# EAGLE design Projekt2 (EAGLE 8.4.0)
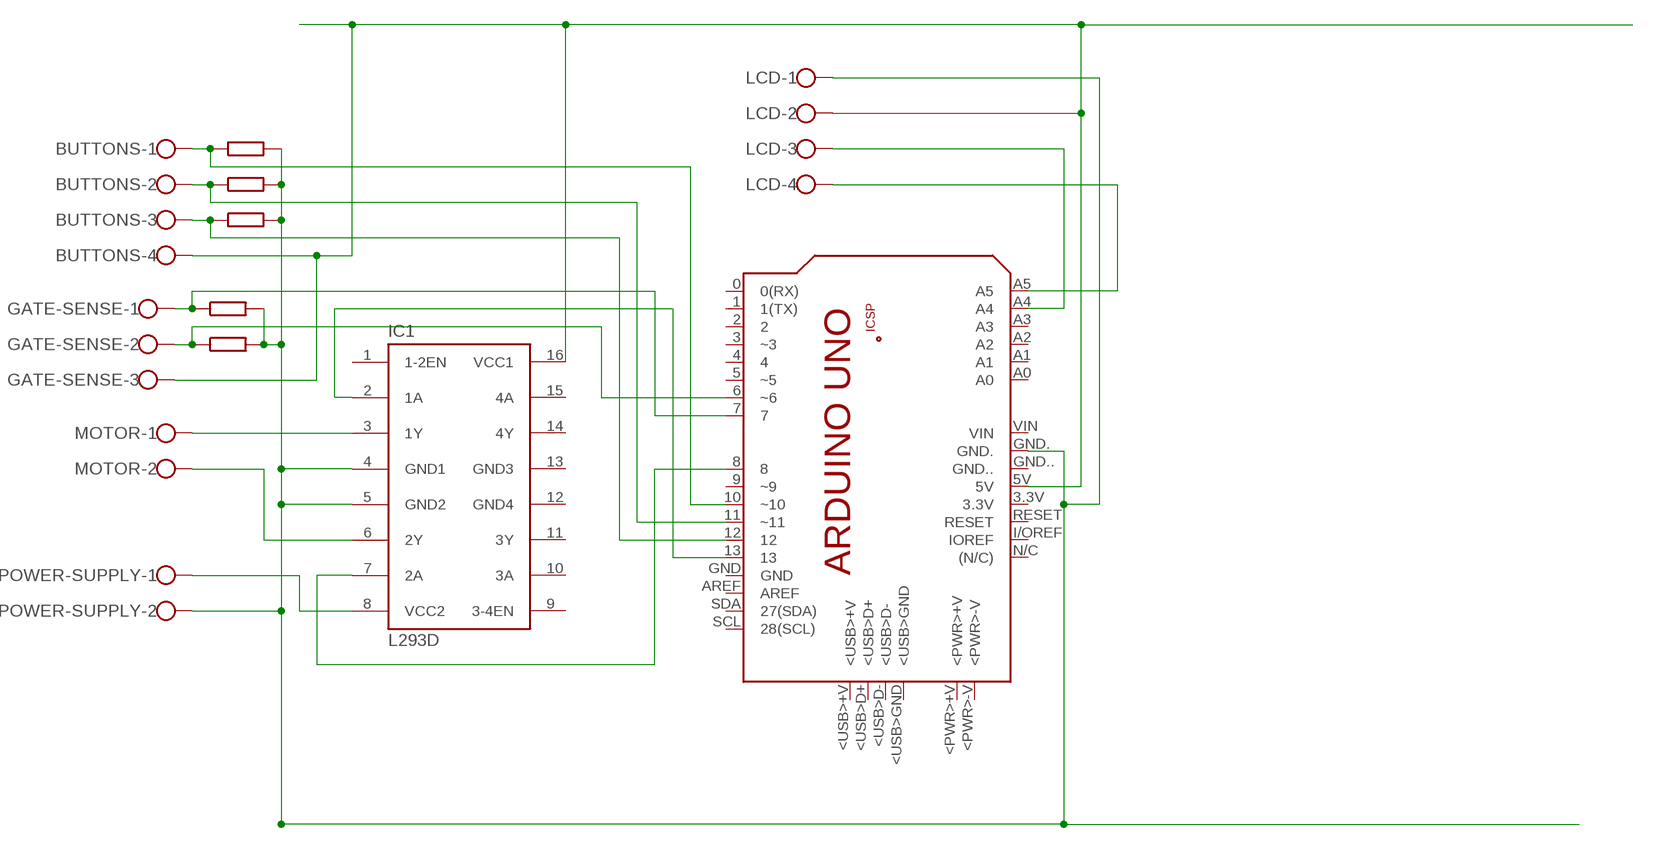
[diagram p0: schematic, sheet 1]

## Parts
BUTTONS  W239-104  [W239-104]
GATE-SENSE  W237-103  [W237-103]
IC1  L293D  [DIL16]
LCD  W237-4  [W237-4]
MOTOR  W237-102  [W237-102]
PCB1  ARDUINO_UNO  [ARDUINO_UNO]
POWER-SUPPLY  W237-102  [W237-102]

## Nets
N$1: IC1.4(GND1) IC1.5(GND2) LCD.1 PCB1.GND. POWER-SUPPLY.2
N$2: BUTTONS.4 GATE-SENSE.3 IC1.16(VCC1) LCD.2 PCB1.5V
N$3: IC1.2(1A) PCB1.13
N$4: IC1.3(1Y) MOTOR.1
N$5: IC1.6(2Y) MOTOR.2
N$6: IC1.7(2A) PCB1.8
N$7: IC1.8(VCC2) POWER-SUPPLY.1
N$8: BUTTONS.1 PCB1.10(~10)
N$9: BUTTONS.2 PCB1.11(~11)
N$10: BUTTONS.3 PCB1.12
N$11: GATE-SENSE.1 PCB1.7
N$12: GATE-SENSE.2 PCB1.6(~6)
N$14: LCD.3 PCB1.A4
N$15: LCD.4 PCB1.A5
Unconnected: IC1.1(1-2EN) IC1.9(3-4EN) IC1.10(3A) IC1.11(3Y) IC1.14(4Y) IC1.15(4A) PCB1.0(0(RX)) PCB1.1(1(TX)) PCB1.2 PCB1.3(~3) PCB1.3.3V PCB1.4 PCB1.5(~5) PCB1.9(~9) PCB1.+5V PCB1.<PWR>+V PCB1.<PWR>-V PCB1.<USB>+V PCB1.<USB>D+ PCB1.<USB>D- PCB1.<USB>GND PCB1.A0 PCB1.A1 PCB1.A2 PCB1.A3 PCB1.AREF PCB1.GND PCB1.GND.. PCB1.GND_ PCB1.I/OREF(IOREF) PCB1.MISO PCB1.MOSI PCB1.N/C((N/C)) PCB1.RESET PCB1.RESET. PCB1.SCK PCB1.SCL(28(SCL)) PCB1.SDA(27(SDA)) PCB1.VIN

## Power pins joined to a net without a drawn wire
GND3: IC1.13(GND3)
GND4: IC1.12(GND4)

## Library data of the parts
BUTTONS = con-wago-500:W239-104: WAGO SCREW CLAMP; OC_FARNELL: unknown; OC_NEWARK: unknown
GATE-SENSE = con-wago-500:W237-103: WAGO SCREW CLAMP; MPN: 237-103; OC_FARNELL: unknown; OC_NEWARK: 18M7116
IC1 = st-microelectronics:L293D: PUSH-PULL 4 CHANNEL DRIVER; MPN: L293D; OC_FARNELL: 9589619; OC_NEWARK: 56P8249
LCD = con-wago-500:W237-4: WAGO SCREW CLAMP; OC_FARNELL: unknown; OC_NEWARK: unknown
MOTOR POWER-SUPPLY = con-wago-500:W237-102: WAGO SCREW CLAMP; MPN: 237-102; OC_FARNELL: unknown; OC_NEWARK: 70K9898
PCB1 = E14_Arduino_revC:ARDUINO_UNO: Device for representing an Arduino Uno board with a footprint in an EAGLE design. Created by Dave Young for Element14. More EAGLE documentation at: http://www.element14.com/community/community/knode/cadsoft_eagle

## Board
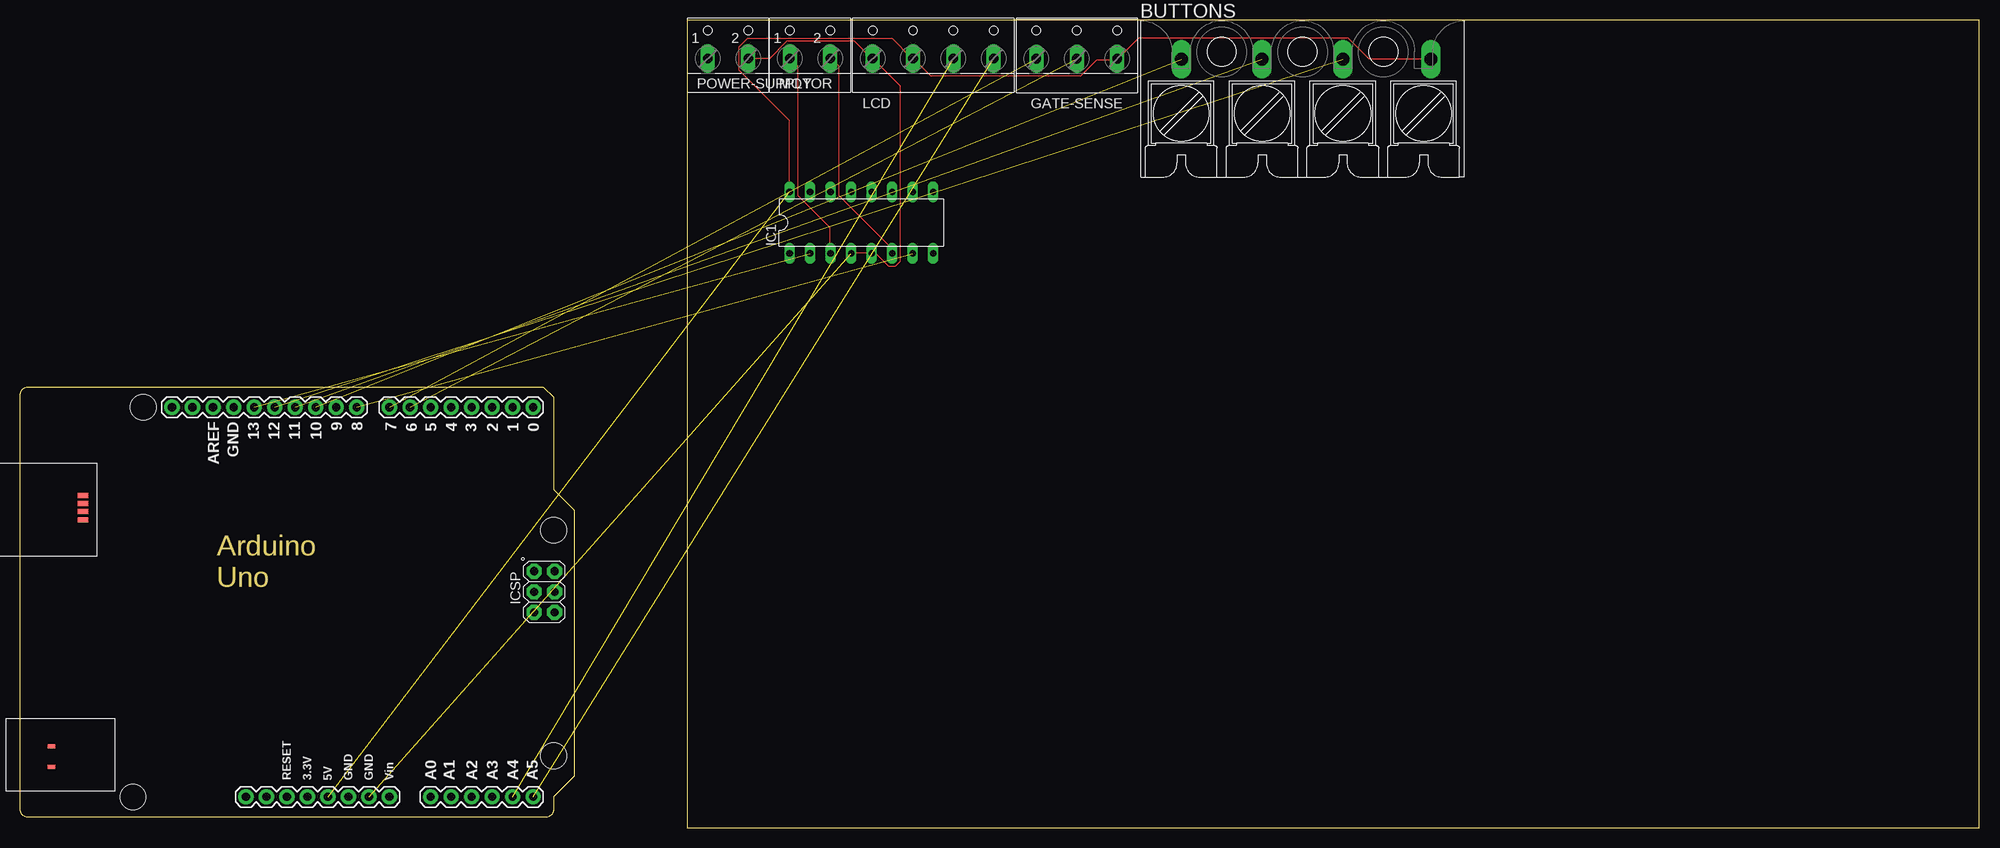
[diagram p1: board, top side]
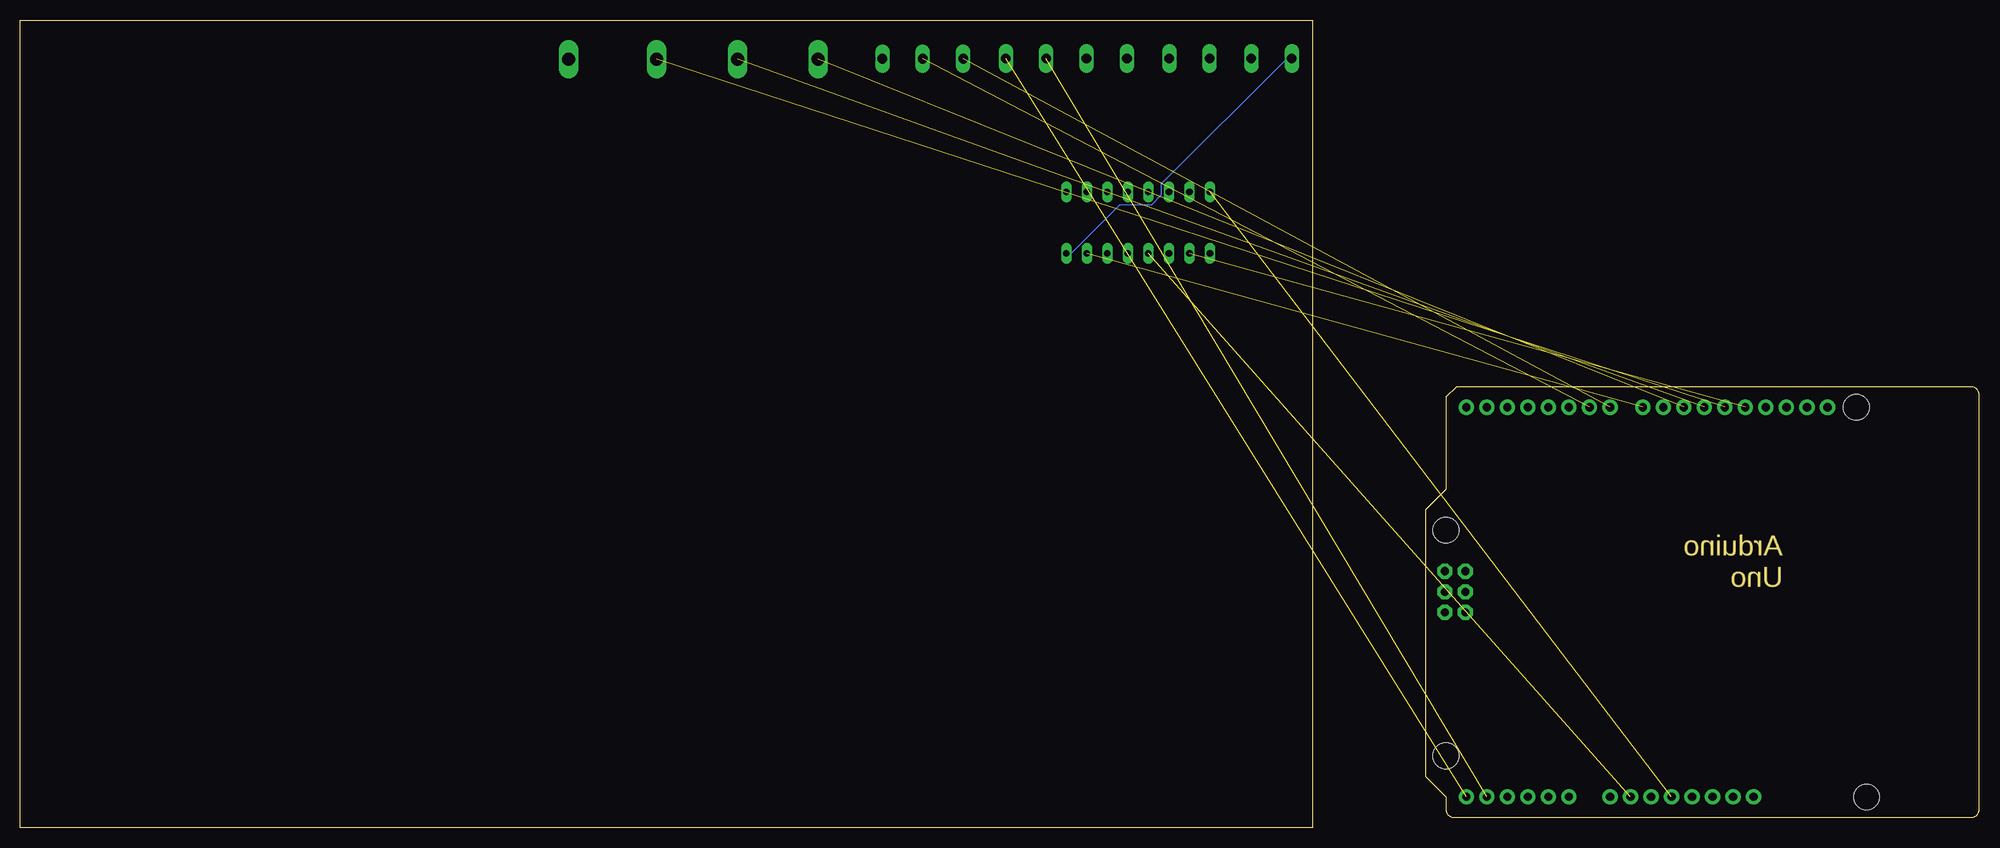
[diagram p2: board, bottom side, seen from below]

Size 160 x 100 mm. Coordinates in mm from the lower left corner, seen from the top.
Outline: 0,0 160,0 160,100 0,100 0,0
Copper layers (1*16): Top 0.035mm / dielectric 1.5mm / Bottom 0.035mm
Design rules "default": minimum track width 6mil, minimum drill 0.35mm, track to track 6mil, track to pad 6mil, pad to pad 6mil, via to via 6mil, smd to smd 6mil, copper to edge 40mil, drill to drill 6mil, minimum pad ring 10mil, minimum via ring 8mil, stop-mask expansion 4mil, vias tented up to drill 0mil, thermal gap 10mil

### Footprints (pad centres in the part's own frame; a part is rotated, then mirrored left to right if it is on the bottom)
W239-104 = drill 1.6 long: 1 -15,5; 2 -5,5; 3 5,5; 4 15.9,5
W237-103 = drill 1.194 long: 1 -5,-1.29; 2 0,-1.29; 3 5,-1.29
DIL16 = drill 0.813 long: 1 -8.89,-3.81; 2 -6.35,-3.81; 3 -3.81,-3.81; 4 -1.27,-3.81; 5 1.27,-3.81; 6 3.81,-3.81; 7 6.35,-3.81; 8 8.89,-3.81; 9 8.89,3.81; 10 6.35,3.81; 11 3.81,3.81; 12 1.27,3.81; 13 -1.27,3.81; 14 -3.81,3.81; 15 -6.35,3.81; 16 -8.89,3.81
W237-4 = drill 1.194 long: 1 -7.5,-1.27; 2 -2.5,-1.27; 3 2.5,-1.27; 4 7.5,-1.27
W237-102 = drill 1.194 long: 1 -2.5,-1.27; 2 2.5,-1.27
ARDUINO_UNO = drill 1.016 pad 1.88: 0 63.5,50.8; 1 60.96,50.8; 2 58.42,50.8; 3 55.88,50.8; 3.3V 35.56,2.54; 4 53.34,50.8; 5 50.8,50.8; 5V 38.1,2.54; 6 48.26,50.8; 7 45.72,50.8; 8 41.656,50.8; 9 39.116,50.8; 10 36.576,50.8; 11 34.036,50.8; 12 31.496,50.8; 13 28.956,50.8; A0 50.8,2.54; A1 53.34,2.54; A2 55.88,2.54; A3 58.42,2.54; A4 60.96,2.54; A5 63.5,2.54; AREF 23.876,50.8; GND 26.416,50.8; GND. 43.18,2.54; GND.. 40.64,2.54; I/OREF 30.48,2.54; N/C 27.94,2.54; RESET 33.02,2.54; SCL 18.796,50.8; SDA 21.336,50.8; VIN 45.72,2.54 | drill 1.016 pad 1.88 octagon: +5V 66.167,30.48; GND_ 66.167,25.4; MISO 63.627,30.48; MOSI 66.167,27.94; RESET. 63.627,25.4; SCK 63.627,27.94 | smd 1.016 x 0.508: <PWR>+V 3.861,8.814; <PWR>-V 3.861,6.274 | smd 1.27 x 0.635: <USB>+V 7.772,39.878; <USB>D+ 7.772,38.887; <USB>D- 7.772,37.871; <USB>GND 7.772,36.83 | hole 3.2: 66.04,7.62; 66.04,35.56; 15.24,50.8; 13.97,2.54

### Placement (x,y rotation side)
BUTTONS  76.2,90.17 0 top
GATE-SENSE  48.26,96.52 0 top
IC1  21.59,74.93 0 top
LCD  30.48,96.52 0 top
MOTOR  15.24,96.52 0 top
PCB1  -82.55,1.27 0 top  (outside the outline)
POWER-SUPPLY  5.08,96.52 0 top

### Tracks (layer width: path | path; a pad name or v marks a point on that pad's centre or on a via)
N$1  (1 unrouted)
  Top 0.152: IC1.4 20.42,71.17 22.86,71.17 IC1.5 22.86,71.02 23.47,71.02 24.99,69.49 25.76,69.49 26.36,70.1 26.36,91.9 23.01,95.25 LCD.1 22.86,95.25 20.73,97.38 12.34,97.38 10.21,95.25 POWER-SUPPLY.2
N$2  (1 unrouted)
  Top 0.152: IC1.16 12.65,78.79 12.65,87.63 6.4,93.88 6.4,96.62 7.47,97.69 25.45,97.69 27.89,95.25 LCD.2 28.04,95.25 30.18,93.12 48.77,93.12 50.75,95.1 53.19,95.1 GATE-SENSE.3 53.34,95.25 55.93,97.84 81.84,97.84 84.43,95.25 92.05,95.25 BUTTONS.4
N$3  (1 unrouted)
N$4
  Top 0.152: IC1.3 17.68,71.17 17.68,74.37 13.72,78.33 13.72,94.34 12.8,95.25 MOTOR.1
N$5
  Top 0.152: IC1.6 25.3,71.17 25.3,71.78 18.75,78.33 18.75,94.34 17.83,95.25 MOTOR.2
N$6  (1 unrouted)
N$7
  Bottom 0.152: POWER-SUPPLY.1 3.2,95.25 18.75,79.7 18.75,78.33 19.96,77.11 23.93,77.11 29.87,71.17 30.48,71.17 IC1.8
N$8  (1 unrouted)
N$9  (1 unrouted)
N$10  (1 unrouted)
N$11  (1 unrouted)
N$12  (1 unrouted)
N$14  (1 unrouted)
N$15  (1 unrouted)